# EAGLE design KGM Feedback v2.0 (EAGLE 6.1)
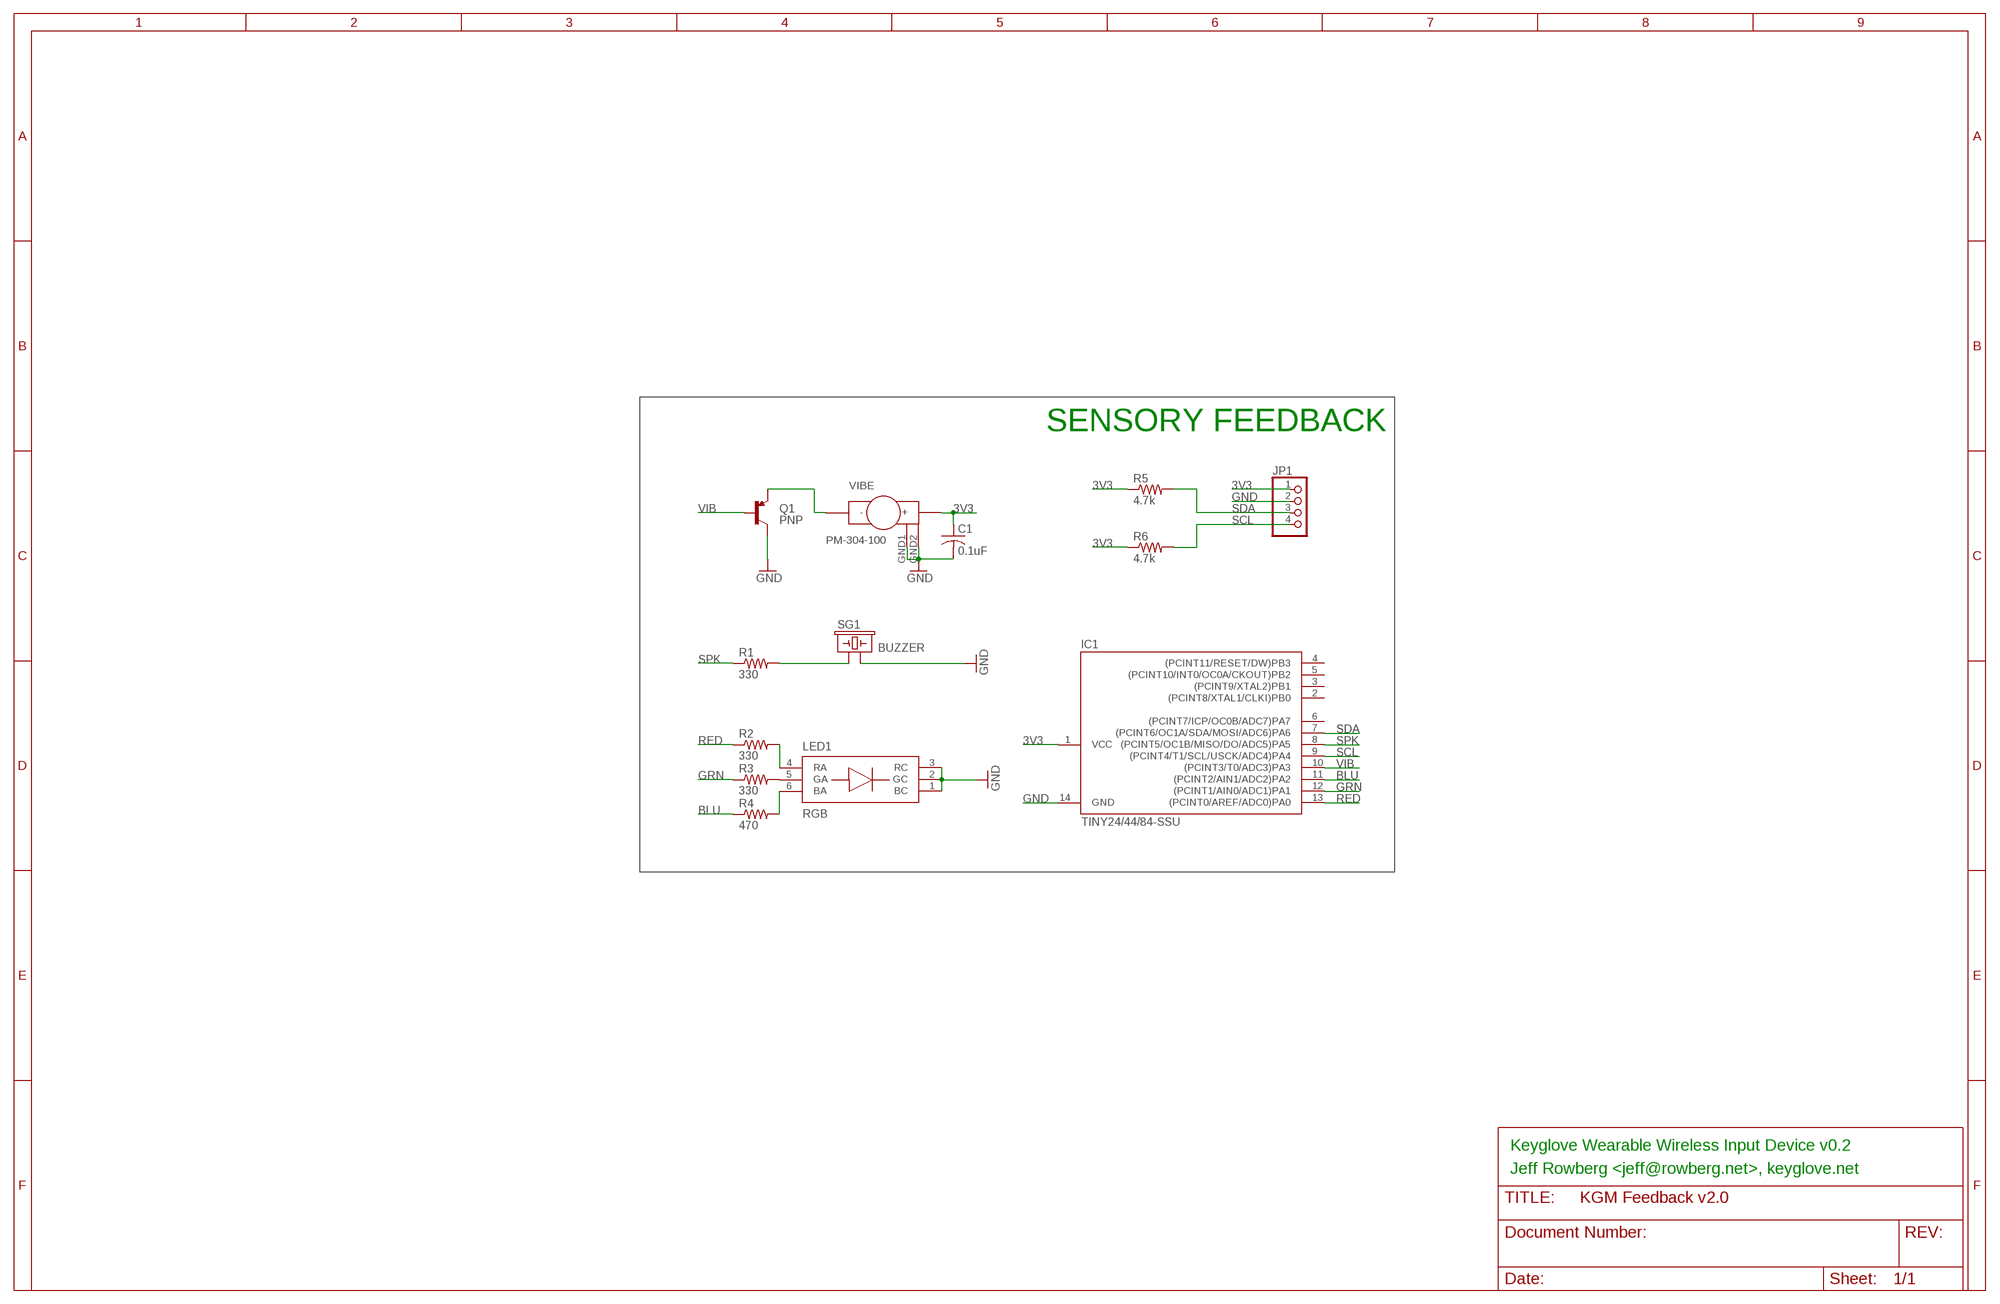
[diagram p0: schematic, sheet 1]

## Parts
C1  0.1uF  C-USC0603  [C0603]
IC1  TINY24/44/84-SSU  [SOIC14]
JP1  PINHD-1X4  [1X04]
LED1  RGB  ASMT-YTB2  [PLCC-6]
Q1  PNP  TRANSISTOR_PNPSMD  [SOT23-3]
R1  330  R-US_R0603  [R0603]
R2  330  R-US_R0603  [R0603]
R3  330  R-US_R0603  [R0603]
R4  470  R-US_R0603  [R0603]
R5  4.7k  R-US_R0603  [R0603]
R6  4.7k  R-US_R0603  [R0603]
SG1  BUZZER  BUZZERSMD3  [BUZZER-CMT1102]
VIBE  PM-304-100  [PM-304-100]

## Nets
3V3 [power]: C1.1 IC1.1(VCC) JP1.1 R5.1 R6.1 VIBE.+
BLU: IC1.11((PCINT2/AIN1/ADC2)PA2) R4.1
GND [power]: C1.2 IC1.14(GND) JP1.2 LED1.1(BC) LED1.2(GC) LED1.3(RC) Q1.3(C) SG1.2 VIBE.GND1(GND) VIBE.GND2(GND)
GRN: IC1.12((PCINT1/AIN0/ADC1)PA1) R3.1
N$1: R1.2 SG1.1
N$2: LED1.5(GA) R3.2
N$3: LED1.4(RA) R2.2
N$4: LED1.6(BA) R4.2
N$15 [power]: Q1.2(E) VIBE.-
RED: IC1.13((PCINT0/AREF/ADC0)PA0) R2.1
SCL: IC1.9((PCINT4/T1/SCL/USCK/ADC4)PA4) JP1.4 R6.2
SDA: IC1.7((PCINT6/OC1A/SDA/MOSI/ADC6)PA6) JP1.3 R5.2
SPK: IC1.8((PCINT5/OC1B/MISO/DO/ADC5)PA5) R1.1
VIB: IC1.10((PCINT3/T0/ADC3)PA3) Q1.1(B)
Unconnected: IC1.2((PCINT8/XTAL1/CLKI)PB0) IC1.3((PCINT9/XTAL2)PB1) IC1.4((PCINT11/RESET/DW)PB3) IC1.5((PCINT10/INT0/OC0A/CKOUT)PB2) IC1.6((PCINT7/ICP/OC0B/ADC7)PA7)

## Notes on the sheet
- SENSORY FEEDBACK
- Keyglove Wearable Wireless Input Device v0.2
- Jeff Rowberg <jeff@rowberg.net>, keyglove.net

## Library data of the parts
C1 = resistor:C-US: CAPACITOR, American symbol
IC1 = avr-7:TINY24/44/84
JP1 = sf-pinhead:PINHD-1X4: PIN HEADER
LED1 = sf-keyglove:ASMT-YTB2
Q1 = SparkFun:TRANSISTOR_PNP
R1-R6 = resistor:R-US_: RESISTOR, American symbol
SG1 = SparkFun:BUZZER: Buzzer 12mm Spark Fun Electronics SKU : Comp-Buzzer
VIBE = sf-keyglove:PM-304-100

## Net classes
0 default: width 0.152 mm, drill 0.305 mm, clearance 0.152 mm
1 power: width 0.254 mm, drill 0.305 mm, clearance 0.152 mm

## Board
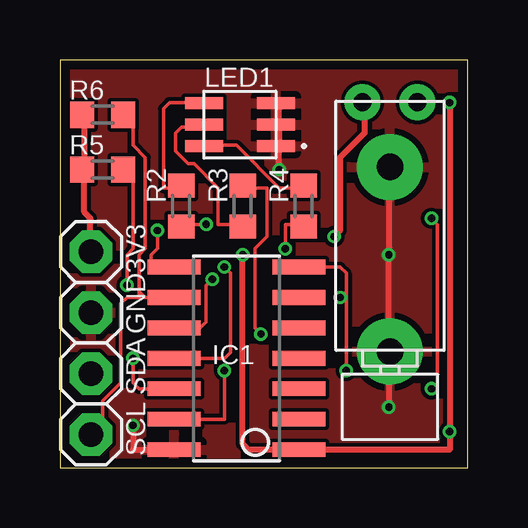
[diagram p1: board, top side]
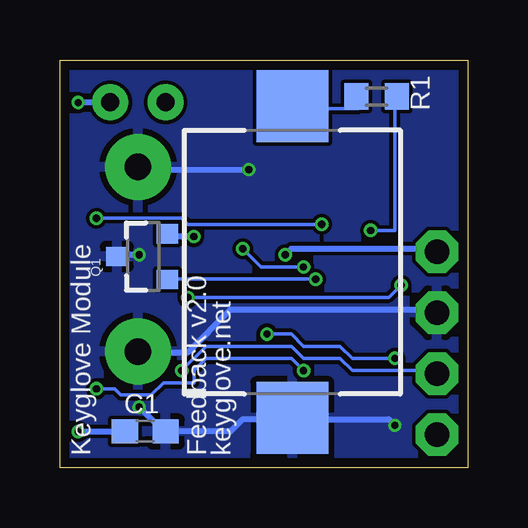
[diagram p2: board, bottom side, seen from below]

Size 17.02 x 17.02 mm. Coordinates in mm from the lower left corner, seen from the top.
Outline: 0,0 17.02,0 17.02,17.02 0,17.02 0,0
Copper layers (1*16): Top 0.0356mm / dielectric 1.5011mm / Bottom 0.0356mm
Design rules: minimum track width 6mil, minimum drill 12mil, track to track 6mil, track to pad 6mil, pad to pad 6mil, via to via 6mil, smd to smd 6mil, copper to edge 15mil, drill to drill 6mil, minimum pad ring 6mil, minimum via ring 5mil, stop-mask expansion 4mil, vias tented up to drill 20mil, thermal gap 10mil

### Footprints (pad centres in the part's own frame; a part is rotated, then mirrored left to right if it is on the bottom)
C0603 = smd 1.1 x 1: 1 -0.85,0; 2 0.85,0
SOIC14 = smd 0.61 x 2.21: 1 -3.81,-2.603; 2 -2.54,-2.603; 3 -1.27,-2.603; 4 0,-2.603; 5 1.27,-2.603; 6 2.54,-2.603; 7 3.81,-2.603; 8 3.81,2.603; 9 2.54,2.603; 10 1.27,2.603; 11 0,2.603; 12 -1.27,2.603; 13 -2.54,2.603; 14 -3.81,2.603
1X04 = drill 1.016 pad 1.778 octagon: 1 -3.81,0; 2 -1.27,0; 3 1.27,0; 4 3.81,0
PLCC-6 = smd 1.6 x 0.5: 1 1.5,-0.9; 2 1.5,0; 3 1.5,0.9; 4 -1.5,0.9; 5 -1.5,0; 6 -1.5,-0.9
SOT23-3 = smd 0.8 x 0.9: 1 -0.95,-1; 2 0.95,-1; 3 0,1.1
R0603 = smd 1 x 1.1: 1 -0.85,0; 2 0.85,0
BUZZER-CMT1102 = smd 3 x 3: 1 -6.5,0; 2 6.5,0
PM-304-100 = drill 0.75 pad 1.5: + 2.7,-1.15; - 2.7,1.15 | drill 1.1 pad 2.75: GND1 0,0; GND2 -7.7,0

### Placement (x,y rotation side)
C1  13.46,1.52 0 bottom
IC1  7.37,4.57 90 top
JP1  1.3,5.21 270 top
LED1  7.51,14.32 0 top
Q1  13.54,8.82 90 bottom
R1  3.81,15.49 180 bottom
R2  5.05,10.92 90 top
R3  7.62,10.92 270 top
R4  10.16,10.92 90 top
R5  1.78,12.45 0 top
R6  1.78,14.73 0 top
SG1  7.32,8.59 270 bottom
VIBE  13.76,12.55 90 top

### Tracks (layer width: path | path; a pad name or v marks a point on that pad's centre or on a via)
3V3  (via drill 0.3)
  Top 0.254: 1.02,12.45 1.02,14.73 R6.1 | 1.02,12.45 1.02,10.67 1.27,10.41 1.27,9.14 JP1.1 | 1.02,12.45 R5.1 | v16.26,15.24 v16.26,1.52 16.26,0.76 IC1.1 7.87,0.76 7.62,1.02 v7.62,8.89
  Bottom 0.254: v16.26,1.52 C1.1 | v16.26,15.24 14.99,15.24 VIBE.+ | v7.62,8.89 7.37,9.14 1.52,9.14 JP1.1
BLU  (via drill 0.3)
  Top 0.152: v9.4,9.14 9.4,10.16 10.16,10.16 R4.1 | v6.86,8.38 7.11,8.13 7.11,4.83 6.86,4.57 IC1.11
  Bottom 0.152: v9.4,9.14 8.64,8.38 v6.86,8.38
GND  (via drill 0.3)
  Top 0.254: LED1.3 9.14,14.99 9.14,14.48 LED1.2 9.14,14.22 9.14,13.46 LED1.1 9.14,13.21 v9.14,12.45 | VIBE.GND1 13.72,12.45 v13.72,8.89 13.72,5.08 VIBE.GND2 13.72,4.83 v13.72,2.54 | IC1.14 3.05,0.76 v3.05,1.78
  Bottom 0.254: v13.72,8.89 14.48,8.89 Q1.3 | v9.14,12.45 13.72,12.45 VIBE.GND1 | v3.05,1.78 3.3,2.03 7.11,2.03 SG1.2 7.37,2.03 9.4,2.03 9.91,1.52 C1.2 12.7,1.52 v13.72,2.54 | JP1.2 1.52,6.6 9.91,6.6 11.68,4.83 13.72,4.83 VIBE.GND2
  pour Bottom: 0.25,16.76 16.76,16.76 16.76,0.25 0.25,0.25
  pour Top: 0.25,16.76 16.76,16.76 16.76,0.25 0.25,0.25
GRN  (via drill 0.3)
  Top 0.152: v8.38,5.59 8.13,5.84 8.13,9.14 8.64,9.65 8.64,11.68 7.62,11.68 R3.1 | v3.05,4.57 3.05,3.56 3.3,3.3 IC1.12
  Bottom 0.152: v8.38,5.59 7.37,5.59 6.86,5.08 5.33,5.08 4.83,4.57 v3.05,4.57
N$1
  Bottom 0.152: R1.2 4.57,15.49 4.57,14.99 7.11,14.99 SG1.1
N$2
  Top 0.152: R3.2 7.62,10.16 6.6,10.16 6.6,11.68 5.59,12.7 5.33,12.7 4.83,13.21 4.83,13.97 5.08,14.22 5.84,14.22 LED1.5
N$3
  Top 0.152: R2.2 4.83,11.68 4.32,11.68 4.32,14.99 4.57,15.24 5.84,15.24 LED1.4
N$4
  Top 0.152: R4.2 10.16,11.68 9.14,11.68 7.37,13.46 6.1,13.46 LED1.6
N$15  (via drill 0.3)
  Top 0.254: v11.43,9.65 11.68,9.91 11.68,12.95 12.7,13.97 12.7,15.24 VIBE.-
  Bottom 0.254: v11.43,9.65 12.45,9.65 Q1.2
RED  (via drill 0.3)
  Top 0.152: IC1.13 6.86,2.03 v6.86,4.06 | v15.49,3.3 15.75,3.56 15.75,10.16 v15.49,10.41 | v6.1,10.16 5.08,10.16 R2.1
  Bottom 0.152: v6.86,4.06 7.37,4.57 10.92,4.57 11.43,4.06 11.43,3.56 12.7,3.56 13.21,3.05 14.48,3.05 14.73,3.3 v15.49,3.3 | v15.49,10.41 11.94,10.41 11.68,10.16 v6.1,10.16
SCL
  Top 0.152: 3.3,7.37 3.3,8.89 3.56,9.14 3.56,12.95 3.05,13.46 3.05,14.48 2.79,14.73 R6.2 | 3.3,7.37 3.56,7.11 IC1.9 | 3.3,7.37 3.3,7.11 2.79,7.11 2.54,6.86 2.54,3.56 1.78,2.79 1.78,1.78 1.52,1.52 JP1.4
SDA  (via drill 0.3)
  Top 0.152: v2.79,7.62 2.79,8.89 3.05,9.14 3.05,12.19 2.79,12.45 R5.2 | 11.94,7.37 v11.68,7.11 | 11.94,7.37 11.94,8.13 11.68,8.38 IC1.7 | 11.94,7.37 v11.94,4.06
  Bottom 0.152: v2.79,7.62 3.3,7.11 v11.68,7.11 | v11.94,4.06 10.92,5.08 7.37,5.08 6.86,4.57 5.33,4.57 4.83,4.06 1.52,4.06 JP1.3
SPK  (via drill 0.3)
  Top 0.152: v4.06,9.91 4.06,9.14 3.81,8.89 3.81,8.38 IC1.8
  Bottom 0.152: v4.06,9.91 3.05,9.91 3.05,15.49 R1.1
VIB  (via drill 0.3)
  Top 0.152: v6.35,7.87 6.1,7.62 6.1,6.1 5.84,5.84 IC1.10
  Bottom 0.152: v6.35,7.87 12.45,7.87 Q1.1

### Text on the board
tPlace: 3V3 | GND | SDA | SCL
bPlace: keyglove.net | Feedback v2.0 | Keyglove Module